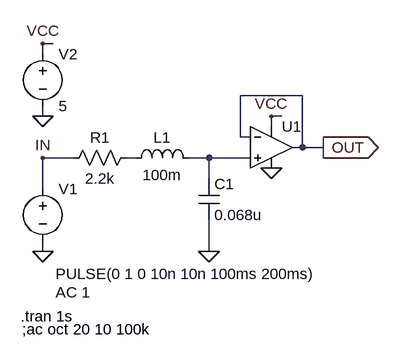
[diagram p0: schematic MIDI_CV_CONV_RLC_LPF.asc]
MIDI_CV_CONV_RLC_LPF.asc, the LTspice schematic file:
Version 4
SHEET 1 880 680
WIRE -32 -64 -48 -64
WIRE -48 -48 -48 -64
WIRE 352 16 256 16
WIRE -48 48 -48 32
WIRE 320 48 304 48
WIRE 304 64 304 48
WIRE 256 80 256 16
WIRE 272 80 256 80
WIRE 352 96 352 16
WIRE 352 96 336 96
WIRE 384 96 352 96
WIRE 0 112 -48 112
WIRE 96 112 80 112
WIRE 208 112 176 112
WIRE 272 112 208 112
WIRE 208 144 208 112
WIRE -48 160 -48 112
WIRE -48 256 -48 240
WIRE 208 256 208 208
FLAG -48 256 0
FLAG -48 112 IN
FLAG 208 256 0
FLAG 304 128 0
FLAG 304 48 VCC
FLAG -48 48 0
FLAG -48 -64 VCC
FLAG 384 96 OUT
IOPIN 384 96 Out
SYMBOL ind 80 128 R270
WINDOW 0 32 56 VTop 2
WINDOW 3 5 56 VBottom 2
SYMATTR InstName L1
SYMATTR Value 100m
SYMBOL res 96 96 R90
WINDOW 0 0 56 VBottom 2
WINDOW 3 32 56 VTop 2
SYMATTR InstName R1
SYMATTR Value 2.2k
SYMBOL cap 192 144 R0
SYMATTR InstName C1
SYMATTR Value 0.068u
SYMBOL voltage -48 144 R0
WINDOW 3 20 147 Left 2
WINDOW 123 20 175 Left 2
WINDOW 39 0 0 Left 2
SYMATTR Value PULSE(0 1 0 10n 10n 100ms 200ms)
SYMATTR Value2 AC 1
SYMATTR InstName V1
SYMBOL Opamps\\UniversalOpamp2 304 96 R0
SYMATTR InstName U1
SYMBOL voltage -48 -64 R0
WINDOW 123 0 0 Left 2
WINDOW 39 0 0 Left 2
SYMATTR InstName V2
SYMATTR Value 5
TEXT -82 356 Left 2 !.tran 1s
TEXT -80 376 Left 2 !;ac oct 20 10 100k

The netlist it stands for:
* MIDI_CV_CONV_RLC_LPF.asc
L1 N001 N002 100m
R1 N001 IN 2.2k
C1 N002 0 0.068u
V1 IN 0 PULSE(0 1 0 10n 10n 100ms 200ms) AC 1
XU1 N002 OUT VCC 0 OUT level.2 Avol=1Meg GBW=10Meg Slew=10Meg ilimit=25m rail=0 Vos=0 phimargin=45 en=0 enk=0 in=0 ink=0 Rin=500Meg  ; pins IN+ IN- V+ V- OUT
V2 VCC 0 5
.tran 1s
;ac oct 20 10 100k
.lib UniversalOpamps2.sub
.backanno
.end